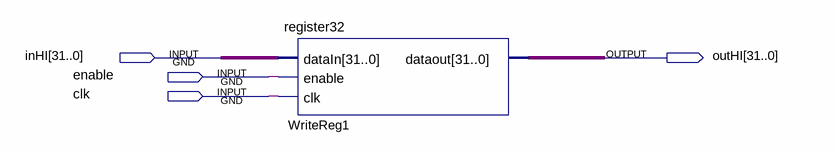
[diagram p0: schematic sheet]
// Quartus schematic HI.bdf as structural Verilog: 1 symbols, 4 pins
module HI (
  input  [31:0] inHI,
  input  enable,
  input  clk,
  output [31:0] outHI
);

  register32 WriteReg1 (.dataIn(inHI), .enable(enable), .clk(clk), .dataout(outHI));

  // Other names for the same wires on the sheet: vcc = enable
endmodule
